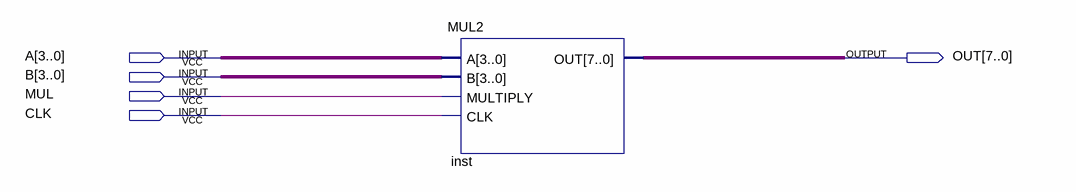
[diagram p0: schematic sheet]
// Quartus schematic MUL2TEST.bdf as structural Verilog: 1 symbols, 5 pins
module MUL2TEST (
  input  [3:0] A,
  input  [3:0] B,
  input  MUL,
  input  CLK,
  output [7:0] OUT
);

  MUL2 inst (.A(A), .B(B), .MULTIPLY(MUL), .CLK(CLK), .OUT(OUT));
endmodule
